# EAGLE design usb2kondo (EAGLE 5.09)
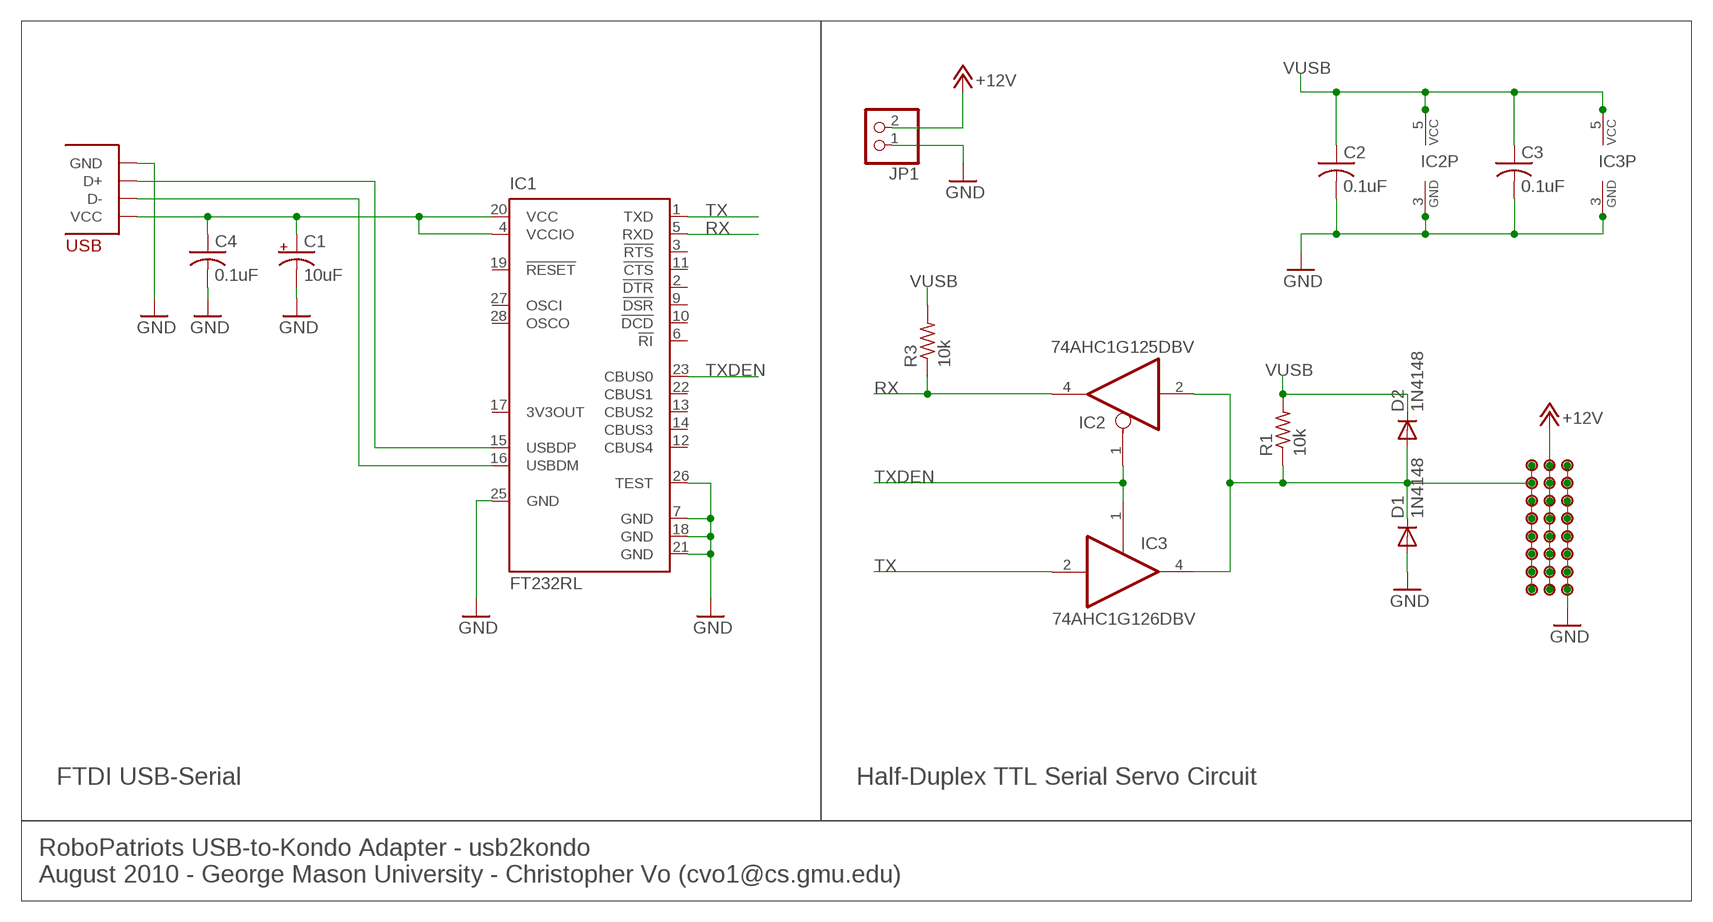
[diagram p0: schematic, sheet 1]

## Parts
C1  10uF  CPOL-USE2,5-6E  [E2,5-6E]
C2  0.1uF  C-US025-025X050  [C025-025X050]
C3  0.1uF  C-US025-025X050  [C025-025X050]
C4  0.1uF  C-US025-025X050  [C025-025X050]
D1  1N4148  1N4148DO35-7  [DO35-7]
D2  1N4148  1N4148DO35-7  [DO35-7]
IC1  FT232RL  [SSOP28]
IC2  74AHC1G125DBV  [SOT23-5]
IC3  74AHC1G126DBV  [SOT23-5]
JP1  PINHD-1X2  [1X02]
R1  10k  R-US_0204/5  [0204/5]
R3  10k  R-US_0204/5  [0204/5]
SERVO  PINHD-3X8  [3X08]
USB  48037-0001  [48037-0001]

## Nets
+12V: JP1.2 SERVO.2 SERVO.5 SERVO.8 SERVO.11 SERVO.14 SERVO.17 SERVO.20 SERVO.23
GND: C1.- C2.2 C3.2 C4.2 D1.A IC1.7(GND) IC1.18(GND) IC1.21(GND) IC1.25(GND) IC1.26(TEST) IC2.3(GND) IC3.3(GND) JP1.1 SERVO.3 SERVO.6 SERVO.9 SERVO.12 SERVO.15 SERVO.18 SERVO.21 SERVO.24 USB.P$4(GND)
N$1: IC1.16(USBDM) USB.P$2(D-)
N$3: IC1.15(USBDP) USB.P$3(D+)
RX: IC1.5(RXD) IC2.4(O) R3.1
SIO: D1.C D2.A IC2.2(I) IC3.4(O) R1.1 SERVO.1 SERVO.4 SERVO.7 SERVO.10 SERVO.13 SERVO.16 SERVO.19 SERVO.22
TX: IC1.1(TXD) IC3.2(I)
TXDEN: IC1.23(CBUS0) IC2.1(OE) IC3.1(OE)
VUSB: C1.+ C2.1 C3.1 C4.1 D2.C IC1.4(VCCIO) IC1.20(VCC) IC2.5(VCC) IC3.5(VCC) R1.2 R3.2 USB.P$1(VCC)
Unconnected: IC1.2(!DTR) IC1.3(!RTS) IC1.6(!RI) IC1.9(!DSR) IC1.10(!DCD) IC1.11(!CTS) IC1.12(CBUS4) IC1.13(CBUS2) IC1.14(CBUS3) IC1.17(3V3OUT) IC1.19(!RESET) IC1.22(CBUS1) IC1.27(OSCI) IC1.28(OSCO)

## Notes on the sheet
- FTDI USB-Serial | Half-Duplex TTL Serial Servo Circuit
- RoboPatriots USB-to-Kondo Adapter - usb2kondo
- August 2010 - George Mason University - Christopher Vo (cvo1@cs.gmu.edu)

## Library data of the parts
C1 = resistor:CPOL-US: POLARIZED CAPACITOR, American symbol
C2-C4 = resistor:C-US: CAPACITOR, American symbol
D1 D2 = diode:1N4148: DIODE high speed (Philips)
IC1 = ftdichip:FT232R: Source: http://www.ftdichip.com/Documents/DataSheets/DS_FT232R_v104.pdf
IC2 = 74xx-little-us:74*1G125: Single Bus Buffer Gate with 3-State Output
IC3 = 74xx-little-us:74*1G126: Single Bus Buffer Gate With 3-State Outputs
JP1 = pinhead:PINHD-1X2: PIN HEADER
R1 R3 = rcl:R-US_: RESISTOR, American symbol
SERVO = pinhead:PINHD-3X8: 3x8 Header Pins
USB = usb2kondo:48037-0001

## Board
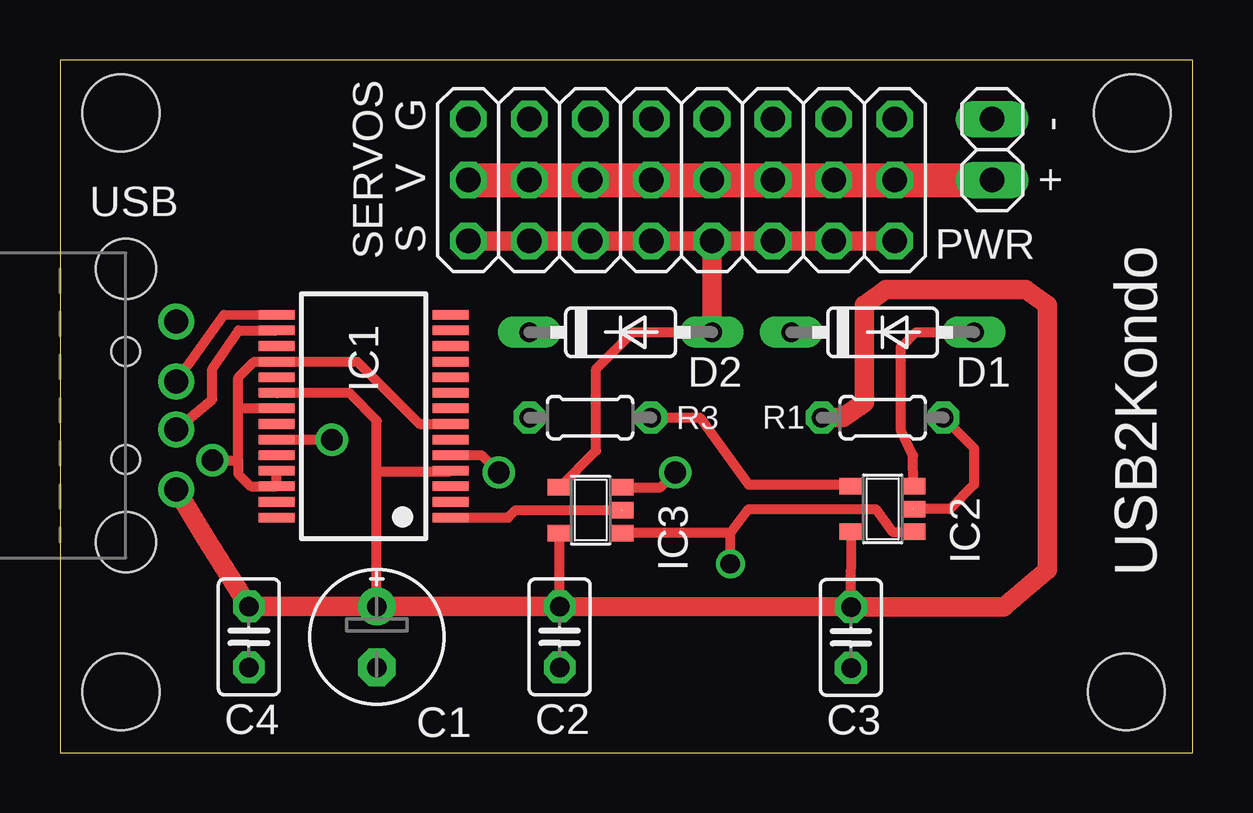
[diagram p1: board, top side]
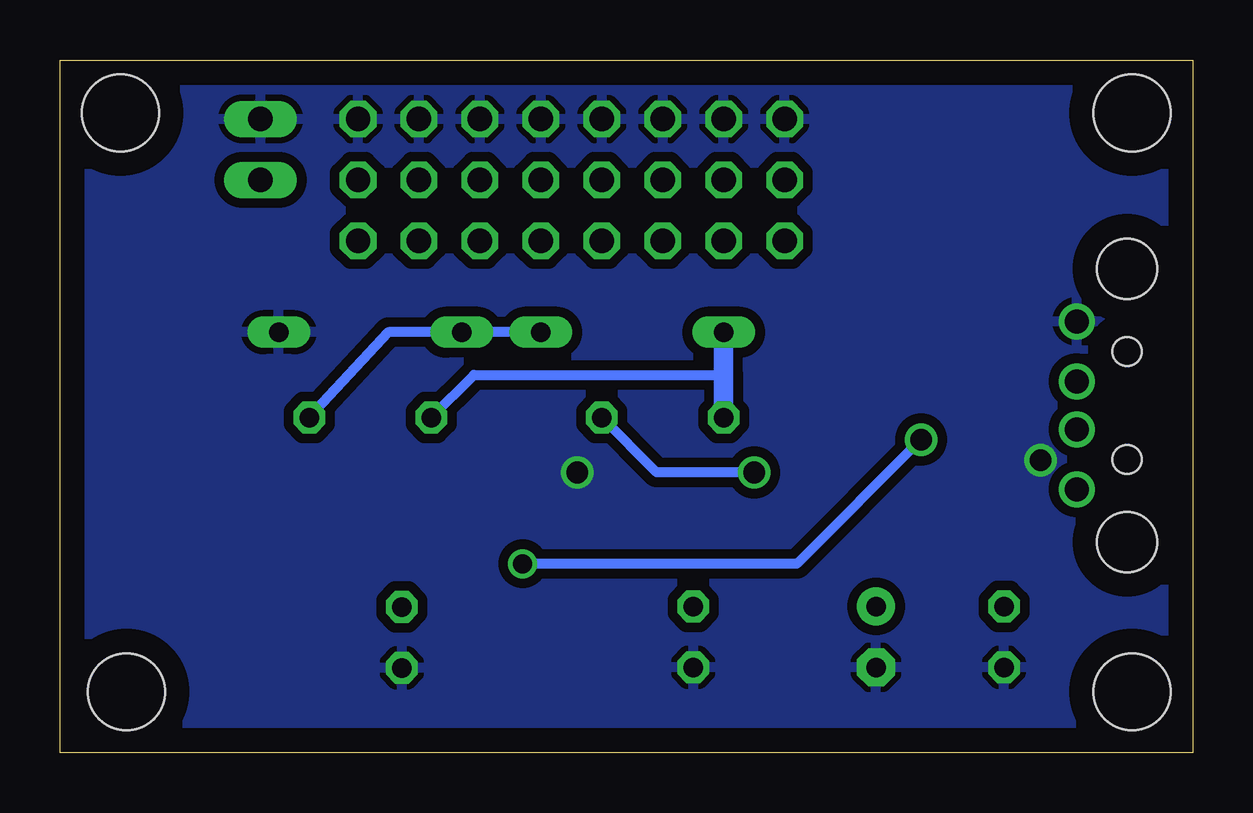
[diagram p2: board, bottom side, seen from below]

Size 47.22 x 28.88 mm. Coordinates in mm from the lower left corner, seen from the top.
Outline: 0,0 47.22,0 47.22,28.88 0,28.88 0,0
Copper layers (1*16): Top 0.035mm / dielectric 1.5mm / Bottom 0.035mm
Design rules "default": minimum track width 10mil, minimum drill 24mil, track to track 8mil, track to pad 8mil, pad to pad 8mil, via to via 8mil, smd to smd 8mil, copper to edge 40mil, drill to drill 8mil, minimum pad ring 10mil, minimum via ring 8mil, stop-mask expansion 4mil, vias tented up to drill 0mil, thermal gap 10mil
Holes 3.2 mm at 2.54,26.67 2.54,2.54 44.7,26.67 44.45,2.54

### Footprints (pad centres in the part's own frame; a part is rotated, then mirrored left to right if it is on the bottom)
E2,5-6E = drill 0.813 pad 1.575 round: + -1.27,0 | drill 0.813 pad 1.575 octagon: - 1.27,0
C025-025X050 = drill 0.813 octagon: 1 -1.27,0; 2 1.27,0
DO35-7 = drill 0.813 long: A 3.81,0; C -3.81,0
SSOP28 = smd 0.4 x 1.5: 1 -4.225,-3.625; 2 -3.575,-3.625; 3 -2.925,-3.625; 4 -2.275,-3.625; 5 -1.625,-3.625; 6 -0.975,-3.625; 7 -0.325,-3.625; 8 0.325,-3.625; 9 0.975,-3.625; 10 1.625,-3.625; 11 2.275,-3.625; 12 2.925,-3.625; 13 3.575,-3.625; 14 4.225,-3.625; 15 4.225,3.625; 16 3.575,3.625; 17 2.925,3.625; 18 2.275,3.625; 19 1.625,3.625; 20 0.975,3.625; 21 0.325,3.625; 22 -0.325,3.625; 23 -0.975,3.625; 24 -1.625,3.625; 25 -2.275,3.625; 26 -2.925,3.625; 27 -3.575,3.625; 28 -4.225,3.625
SOT23-5 = smd 0.69 x 0.99: 1 -0.95,-1.29; 2 0,-1.29; 3 0.95,-1.29; 4 0.95,1.3; 5 -0.95,1.3
1X02 = drill 1.016 long: 1 -1.27,0; 2 1.27,0
0204/5 = drill 0.813 octagon: 1 -2.54,0; 2 2.54,0
3X08 = drill 1.016 octagon: 1 0,0; 2 0,2.54; 3 0,5.08; 4 2.54,0; 5 2.54,2.54; 6 2.54,5.08; 7 5.08,0; 8 5.08,2.54; 9 5.08,5.08; 10 7.62,0; 11 7.62,2.54; 12 7.62,5.08; 13 10.16,0; 14 10.16,2.54; 15 10.16,5.08; 16 12.7,0; 17 12.7,2.54; 18 12.7,5.08; 19 15.24,0; 20 15.24,2.54; 21 15.24,5.08; 22 17.78,0; 23 17.78,2.54; 24 17.78,5.08
48037-0001 = drill 1 round: P$1 3.5,2.1; P$2 1,2.1; P$3 -1,2.1; P$4 -3.5,2.1 | hole 2.5: -5.7,0; 5.7,0 | hole 1.2: -2.25,0; 2.25,0

### Placement (x,y rotation side)
C1  13.21,4.83 270 top
C2  20.83,4.83 270 top
C3  32.97,4.81 270 top
C4  7.87,4.83 270 top
D1  34.29,17.53 0 top
D2  23.37,17.53 0 top
IC1  12.66,14.03 90 top
IC2  34.29,10.16 90 top
IC3  22.12,10.11 90 top
JP1  38.86,25.15 270 top
R1  34.29,13.97 180 top
R3  22.1,13.97 180 top
SERVO  17.02,21.34 0 top
USB  2.74,14.48 270 top

### Tracks (layer width: path | path; a pad name or v marks a point on that pad's centre or on a via)
+12V
  Top 1.422: SERVO.2 SERVO.5 SERVO.8 SERVO.11 SERVO.14 SERVO.17 SERVO.20 SERVO.23 JP1.2
GND  (via drill 0.9)
  Top 0.406: D1.A 35.69,17.53 35.05,16.89 35.05,13.46 35.56,12.4 IC2.3 | 7.43,12.19 7.43,11.62 7.95,11.11 IC1.26 IC1.25 | 7.43,12.19 7.43,14.36 | 7.43,14.36 7.43,15.64 8.09,16.3 IC1.18 12.39,16.3 14.98,13.71 IC1.7 | IC1.21 7.43,14.36 | v6.35,12.19 7.43,12.19 | IC3.3 25.03,11.06 v25.65,11.68
  pour Bottom (isolate 0.406): 0,28.96 0,0 47.24,0 47.24,28.96
N$1
  Top 0.406: USB.P$2 6.35,14.73 6.35,16 7.45,17.61 IC1.16
N$3
  Top 0.406: USB.P$3 6.84,18.26 IC1.15
RX  (via drill 0.9)
  Top 0.406: IC2.4 32.92,11.18 28.7,11.18 26.67,13.97 R3.1 | IC1.5 17.57,12.4 v18.29,11.68
  Bottom 0.406: v18.29,11.68 22.35,11.68 R3.1
SIO
  Top 0.406: IC2.2 37.08,10.16 38.1,11.18 38.1,12.7 R1.1 | IC3.4 22.35,12.59 22.35,16 23.88,17.53 D2.A
  Top 0.813: SERVO.22 SERVO.19 SERVO.16 SERVO.13 | SERVO.13 SERVO.10 SERVO.7 SERVO.4 SERVO.1 | D2.A SERVO.13
  Bottom 0.406: R1.1 33.53,17.53 D1.C D2.A
TX
  Top 0.406: IC1.1 18.68,9.8 18.99,10.11 IC3.2
TXDEN  (via drill 0.8, 0.9)
  Top 0.406: 27.96,9.16 IC3.1 | 27.96,9.16 28.7,10.16 34,10.16 34.7,9.21 IC2.1 | IC1.23 v11.33,13.05 | v27.94,7.87 27.96,7.89 27.96,9.16
  Bottom 0.406: v11.33,13.05 16.51,7.87 v27.94,7.87
VUSB
  Top 0.406: C2.1 IC3.5 | C3.1 IC2.5 | IC1.20 9.05,14.99 12.06,14.99 13.21,13.84 13.21,11.73 | C1.+ 13.21,11.73 | IC1.4 16.26,11.73 13.21,11.73
  Top 0.813: USB.P$1 6.11,8.87 C4.1 C1.+ C2.1 C3.1 39.35,6.08 41.15,7.62 41.15,18.67 40.26,19.3 34.42,19.3 33.53,18.67 33.53,14.61 32.64,13.97 R1.2
  Bottom 0.406: R1.2 29.97,15.75 19.56,15.75
  Bottom 0.813: R3.2 19.56,15.75 D2.C

### Text on the board
tPlace: G | - | V | + | PWR | SERVOS | S | USB2Kondo